# EAGLE design 8x8_ctrl (EAGLE 5.11)
RIPPLE: 500 mA
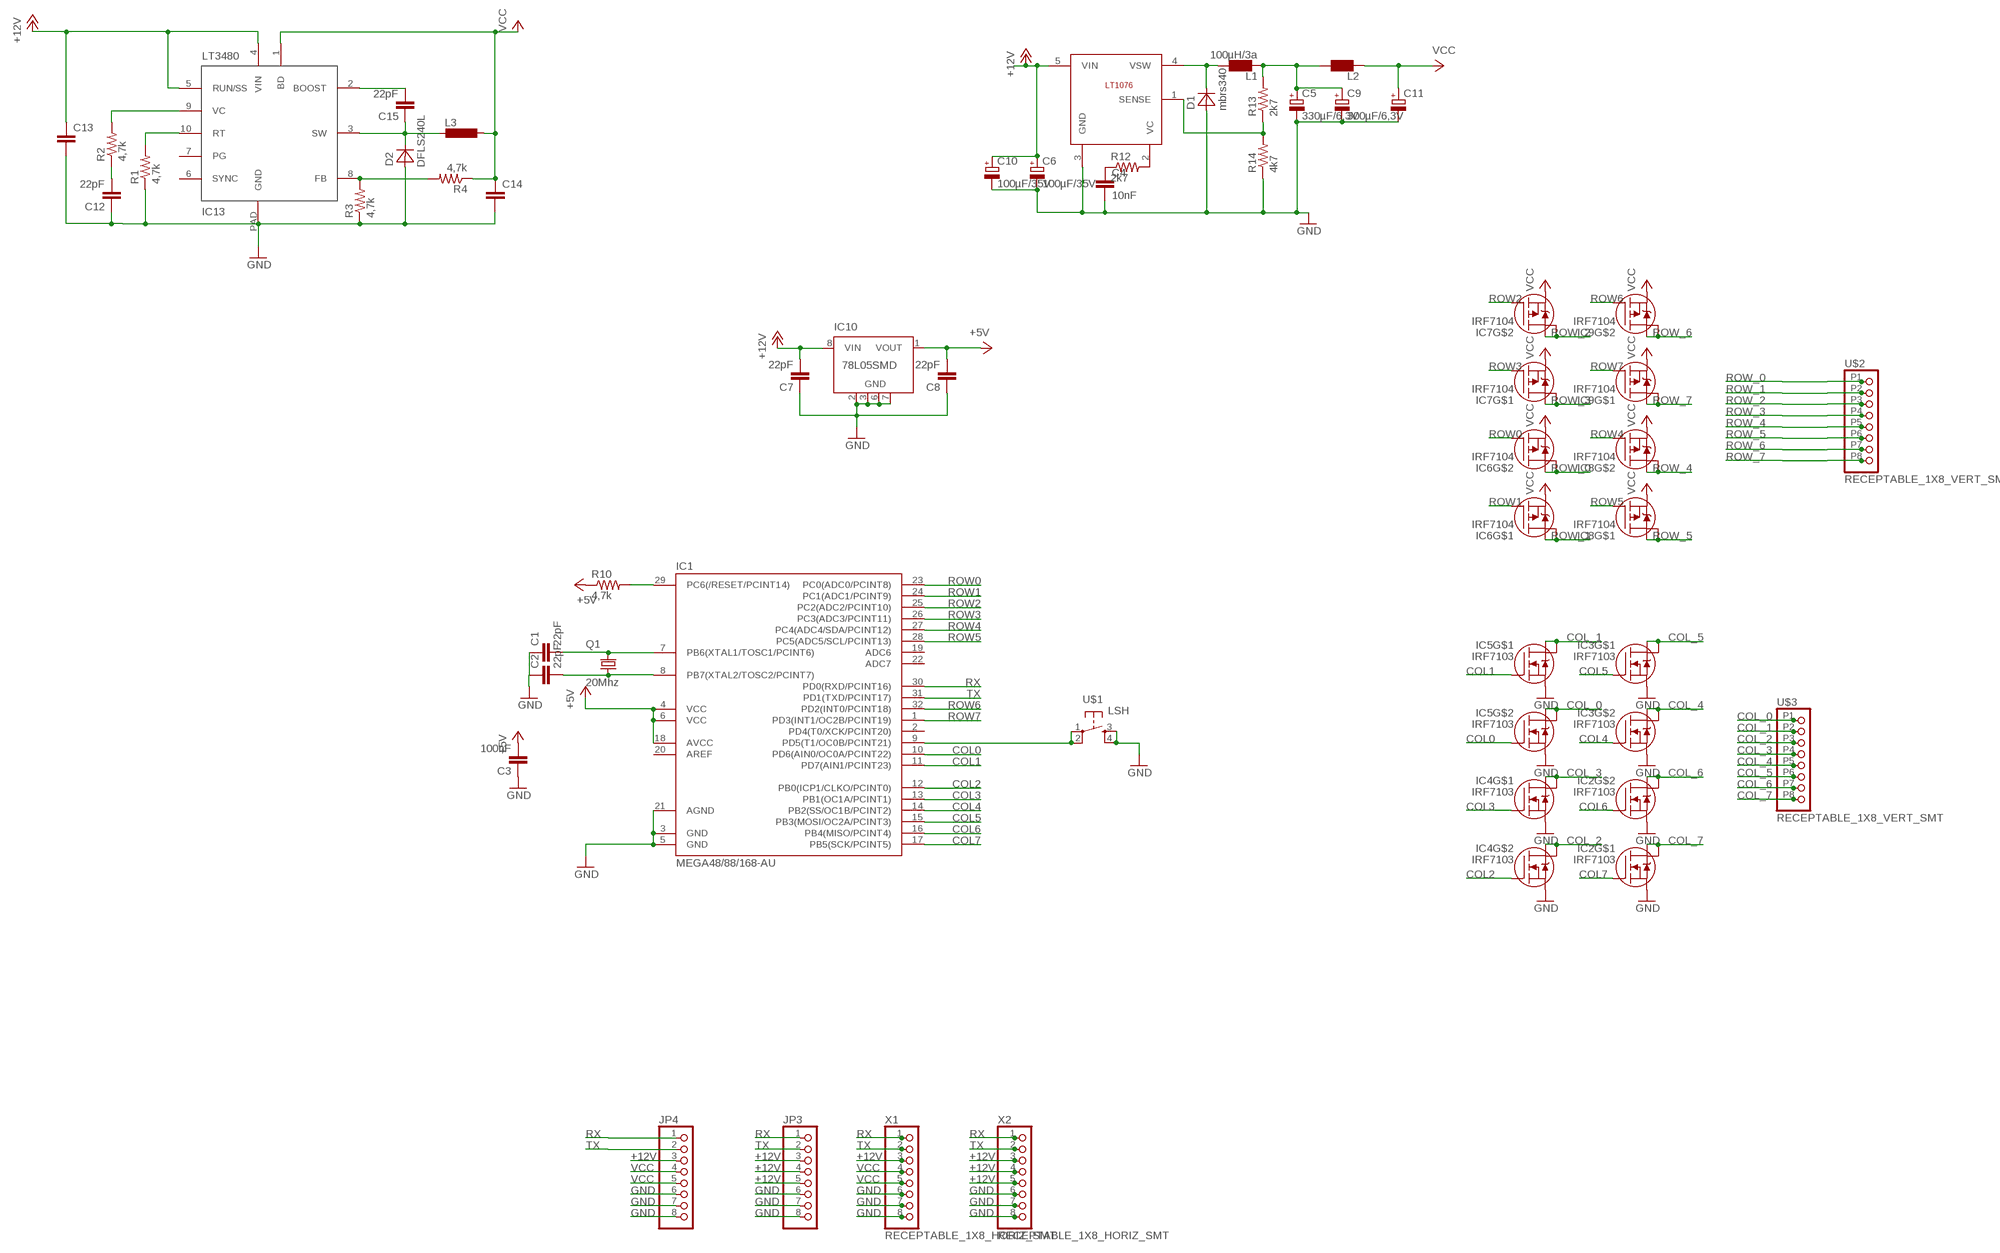
[diagram p0: schematic, sheet 1]

## Parts
C1  22pF  CAP0805  [0805]
C2  22pF  CAP0805  [0805]
C3  100nF  CAP0805  [0805]
C4  10nF  CAP0805  [0805]
C5  330µF/6,3V  CPOL-EUD  [PANASONIC_D]
C6  100µF/35V  CPOL-EUD  [PANASONIC_D]
C7  22pF  CAP0805  [0805]
C8  22pF  CAP0805  [0805]
C9  300µF/6,3V  CPOL-EUD  [PANASONIC_D]
C10  100µF/35V  CPOL-EUD  [PANASONIC_D]
C11  CPOL-EUSMCD  [SMC_D]
C12  22pF  CAP0805  [0805]
C13  CAP1210  [1210]
C14  CAP1210  [1210]
C15  22pF  CAP0805  [0805]
D1  mbrs340  MBRS340  [DO214AB]
D2  DFLS240L  [POWERDI_123]
IC1  MEGA48/88/168-AU  [TQFP32-08]
IC2  IRF7103  [SO8-2]
IC3  IRF7103  [SO8-2]
IC4  IRF7103  [SO8-2]
IC5  IRF7103  [SO8-2]
IC6  IRF7104  [SO8-2]
IC7  IRF7104  [SO8-2]
IC8  IRF7104  [SO8-2]
IC9  IRF7104  [SO8-2]
IC10  78L05SMD  [SO08]
IC12  LT1076  [Q5-DD]
IC13  LT3480  [MSOP10-PAD]
JP3  PINHD-1X08_2.54-SMD-90°  [1X08SMD/90]
JP4  PINHD-1X08_2.54-SMD-90°  [1X08SMD/90]
L1  100µH/3a  L-PISR  [PISR]
L2  L-PISG  [PISG]
L3  DO3316P  [DO3316P]
Q1  20Mhz  X22-OSCILLATOR  [X22]
R1  4,7k  RESISTOR  [0805]
R2  4,7k  RESISTOR  [0805]
R3  4,7k  RESISTOR  [0805]
R4  4,7k  RESISTOR  [0805]
R10  4,7k  RESISTOR  [0805]
R12  2k7  RESISTOR  [0805]
R13  2k7  RESISTOR  [0805]
R14  4k7  RESISTOR  [0805]
U$1  LSH  [LSH]
U$2  RECEPTABLE_1X8_VERT_SMT  [RECEPTABLE_1X8_VERT_SMT]
U$3  RECEPTABLE_1X8_VERT_SMT  [RECEPTABLE_1X8_VERT_SMT]
X1  RECEPTABLE_1X8_HORIZ_SMT  [RECEPTABLE_1X8_HORIZ_SMT]
X2  RECEPTABLE_1X8_HORIZ_SMT  [RECEPTABLE_1X8_HORIZ_SMT]

## Nets
+5V: C3.2 C8.2 IC1.4(VCC) IC1.6(VCC) IC1.18(AVCC) IC10.1(VOUT) R10.1
+12V: C6.+ C7.2 C10.+ C13.1 IC10.8(VIN) IC12.5(VIN) IC13.4(VIN) IC13.5(RUN/SS) JP3.3 JP3.4 JP3.5 JP4.3 X1.3 X1.11 X2.3 X2.4 X2.5 X2.11 X2.12 X2.13
COL0: IC1.10(PD6(AIN0/OC0A/PCINT22)) IC5.4(G)
COL1: IC1.11(PD7(AIN1/PCINT23)) IC5.2(G)
COL2: IC1.12(PB0(ICP1/CLKO/PCINT0)) IC4.4(G)
COL3: IC1.13(PB1(OC1A/PCINT1)) IC4.2(G)
COL4: IC1.14(PB2(SS/OC1B/PCINT2)) IC3.4(G)
COL5: IC1.15(PB3(MOSI/OC2A/PCINT3)) IC3.2(G)
COL6: IC1.16(PB4(MISO/PCINT4)) IC2.4(G)
COL7: IC1.17(PB5(SCK/PCINT5)) IC2.2(G)
COL_0: IC5.5(D) IC5.6(D) U$3.P1
COL_1: IC5.7(D) IC5.8(D) U$3.P2
COL_2: IC4.5(D) IC4.6(D) U$3.P3
COL_3: IC4.7(D) IC4.8(D) U$3.P4
COL_4: IC3.5(D) IC3.6(D) U$3.P5
COL_5: IC3.7(D) IC3.8(D) U$3.P6
COL_6: IC2.5(D) IC2.6(D) U$3.P7
COL_7: IC2.7(D) IC2.8(D) U$3.P8
GND: C1.1 C2.1 C3.1 C4.2 C5.- C6.- C7.1 C8.1 C9.- C10.- C11.- C12.1 C13.2 C14.2 D1.A D2.A IC1.3(GND) IC1.5(GND) IC1.21(AGND) IC2.1(S) IC2.3(S) IC3.1(S) IC3.3(S) IC4.1(S) IC4.3(S) IC5.1(S) IC5.3(S) IC10.2(GND) IC10.3(GND) IC10.6(GND) IC10.7(GND) IC12.3(GND) IC13.PAD(GND) JP3.6 JP3.7 JP3.8 JP4.6 JP4.7 JP4.8 R1.1 R3.1 R14.1 U$1.3 U$1.4 X1.6 X1.7 X1.8 X1.14 X1.15 X1.16 X2.6 X2.7 X2.8 X2.14 X2.15 X2.16
N$1: C2.2 IC1.8(PB7(XTAL2/TOSC2/PCINT7)) Q1.1
N$2: C5.+ C9.+ L1.P$2 L2.P$1 R13.2
N$3: C1.2 IC1.7(PB6(XTAL1/TOSC1/PCINT6)) Q1.3
N$4: IC1.29(PC6(/RESET/PCINT14)) R10.2
N$5: IC12.1(SENSE) R13.1 R14.2
N$6: IC13.10(RT) R1.2
N$7: IC1.9(PD5(T1/OC0B/PCINT21)) U$1.1 U$1.2
N$8: C15.1 D2.K(C) IC13.3(SW) L3.1
N$9: C12.2 R2.1
N$10: IC13.9(VC) R2.2
N$12: IC13.8(FB) R3.2 R4.2
N$15: C15.2 IC13.2(BOOST)
N$17: C4.1 R12.1
N$18: IC12.2(VC) R12.2
N$19: D1.K(C) IC12.4(VSW) L1.P$1
ROW0: IC1.23(PC0(ADC0/PCINT8)) IC6.4(G)
ROW1: IC1.24(PC1(ADC1/PCINT9)) IC6.2(G)
ROW2: IC1.25(PC2(ADC2/PCINT10)) IC7.4(G)
ROW3: IC1.26(PC3(ADC3/PCINT11)) IC7.2(G)
ROW4: IC1.27(PC4(ADC4/SDA/PCINT12)) IC8.4(G)
ROW5: IC1.28(PC5(ADC5/SCL/PCINT13)) IC8.2(G)
ROW6: IC1.32(PD2(INT0/PCINT18)) IC9.4(G)
ROW7: IC1.1(PD3(INT1/OC2B/PCINT19)) IC9.2(G)
ROW_0: IC6.5(D) IC6.6(D) U$2.P1
ROW_1: IC6.7(D) IC6.8(D) U$2.P2
ROW_2: IC7.5(D) IC7.6(D) U$2.P3
ROW_3: IC7.7(D) IC7.8(D) U$2.P4
ROW_4: IC8.5(D) IC8.6(D) U$2.P5
ROW_5: IC8.7(D) IC8.8(D) U$2.P6
ROW_6: IC9.5(D) IC9.6(D) U$2.P7
ROW_7: IC9.7(D) IC9.8(D) U$2.P8
RX: IC1.30(PD0(RXD/PCINT16)) JP3.1 JP4.1 X1.1 X1.9 X2.1 X2.9
TX: IC1.31(PD1(TXD/PCINT17)) JP3.2 JP4.2 X1.2 X1.10 X2.2 X2.10
VCC: C11.+ C14.1 IC6.1(S) IC6.3(S) IC7.1(S) IC7.3(S) IC8.1(S) IC8.3(S) IC9.1(S) IC9.3(S) IC13.1(BD) JP4.4 JP4.5 L2.P$2 L3.2 R4.1 X1.4 X1.5 X1.12 X1.13
Unconnected: IC1.2(PD4(T0/XCK/PCINT20)) IC1.19(ADC6) IC1.20(AREF) IC1.22(ADC7) IC10.4(NC) IC10.5(NC) IC13.6(SYNC) IC13.7(PG)

## Library data of the parts
C1-C4 C7 C8 C12-C15 = SparkFun:CAP: Capacitor Standard 0603 ceramic capacitor, and 0.1" leaded capacitor.
C5 C6 C9-C11 = rcl:CPOL-EU: POLARIZED CAPACITOR, European symbol
D1 = seb:MBRS340
D2 = seb:DFLS240L
IC1 = avr-4:MEGA48/88/168
IC2-IC5 = irf-2:IRF7103: HEXFET® Power MOSFET Adavanced Process Technology Ultra Low On-Resistance Dual N-Channel MOSFET Surface Mount Available in Tape & Reel Dynamic dv/dt Rating Fast Switching Please connect both Drain-Pins of each FET for thermal Reasons! (Pin 5 with Pin 6, 7 with 8)
IC6-IC9 = irf-2:IRF7104: HEXFET® Power MOSFET Adavanced Process Technology Ultra Low On-Resistance Dual P-Channel MOSFET Surface Mount Available in Tape & Reel Dynamic dv/dt Rating Fast Switching Please connect both Drain-Pins of each FET for thermal Reasons! (Pin 5 with Pin 6, 7 with 8)
IC10 = linear:78L*SMD: Positive VOLTAGE REGULATOR
IC12 = seb:LT1076
IC13 = seb:LT3480
JP3 JP4 = pinhead-2:PINHD-1X08: PIN HEADER
L1 = seb:L-PISR
L2 = seb:L-PISG
L3 = inductor-coilcraft:DO3316P: COILCRAFT; OC_FARNELL: unknown; OC_NEWARK: unknown
Q1 = seb:X22-OSCILLATOR
R1-R4 R10 R12-R14 = SparkFun:RESISTOR: Resistor Basic schematic elements and footprints for 0603, 1206, and PTH 1/10th watt (small) resistors.
U$1 = switch-tact:LSH
U$2 U$3 = seb:RECEPTABLE_1X8_VERT_SMT
X1 X2 = seb:RECEPTABLE_1X8_HORIZ_SMT

## Board
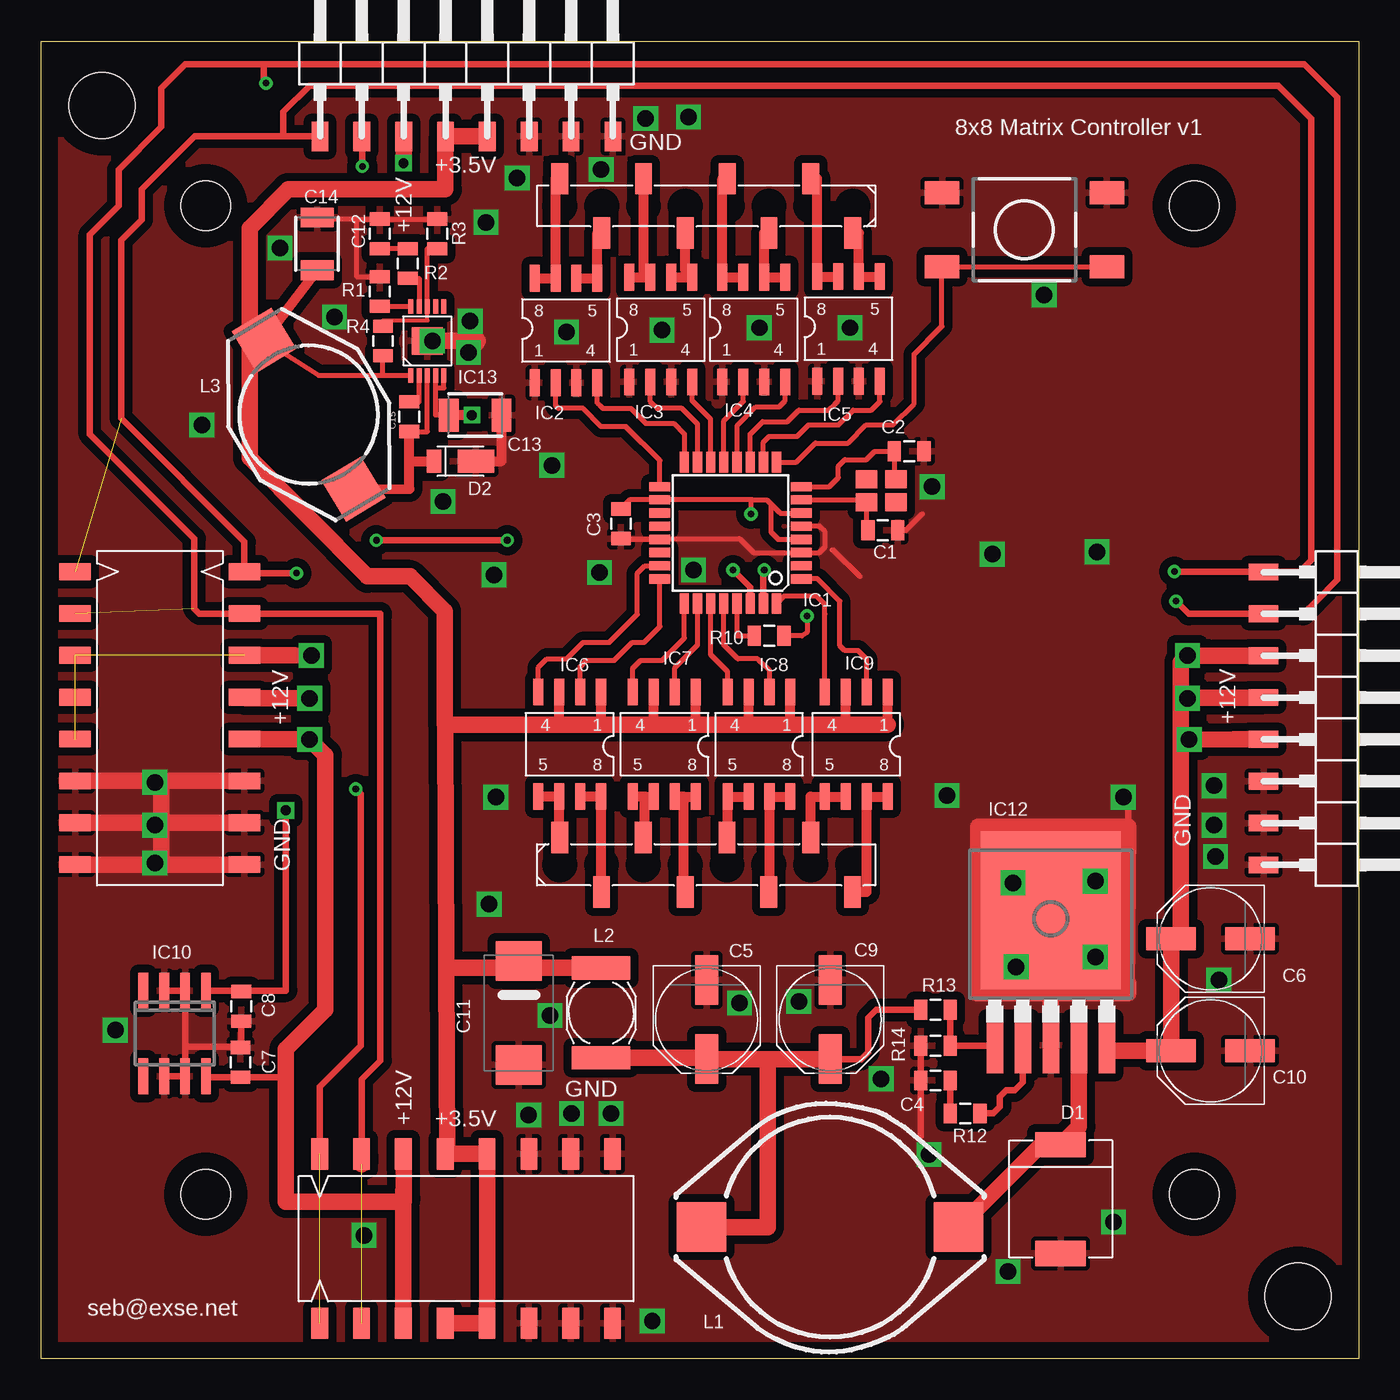
[diagram p1: board, top side]
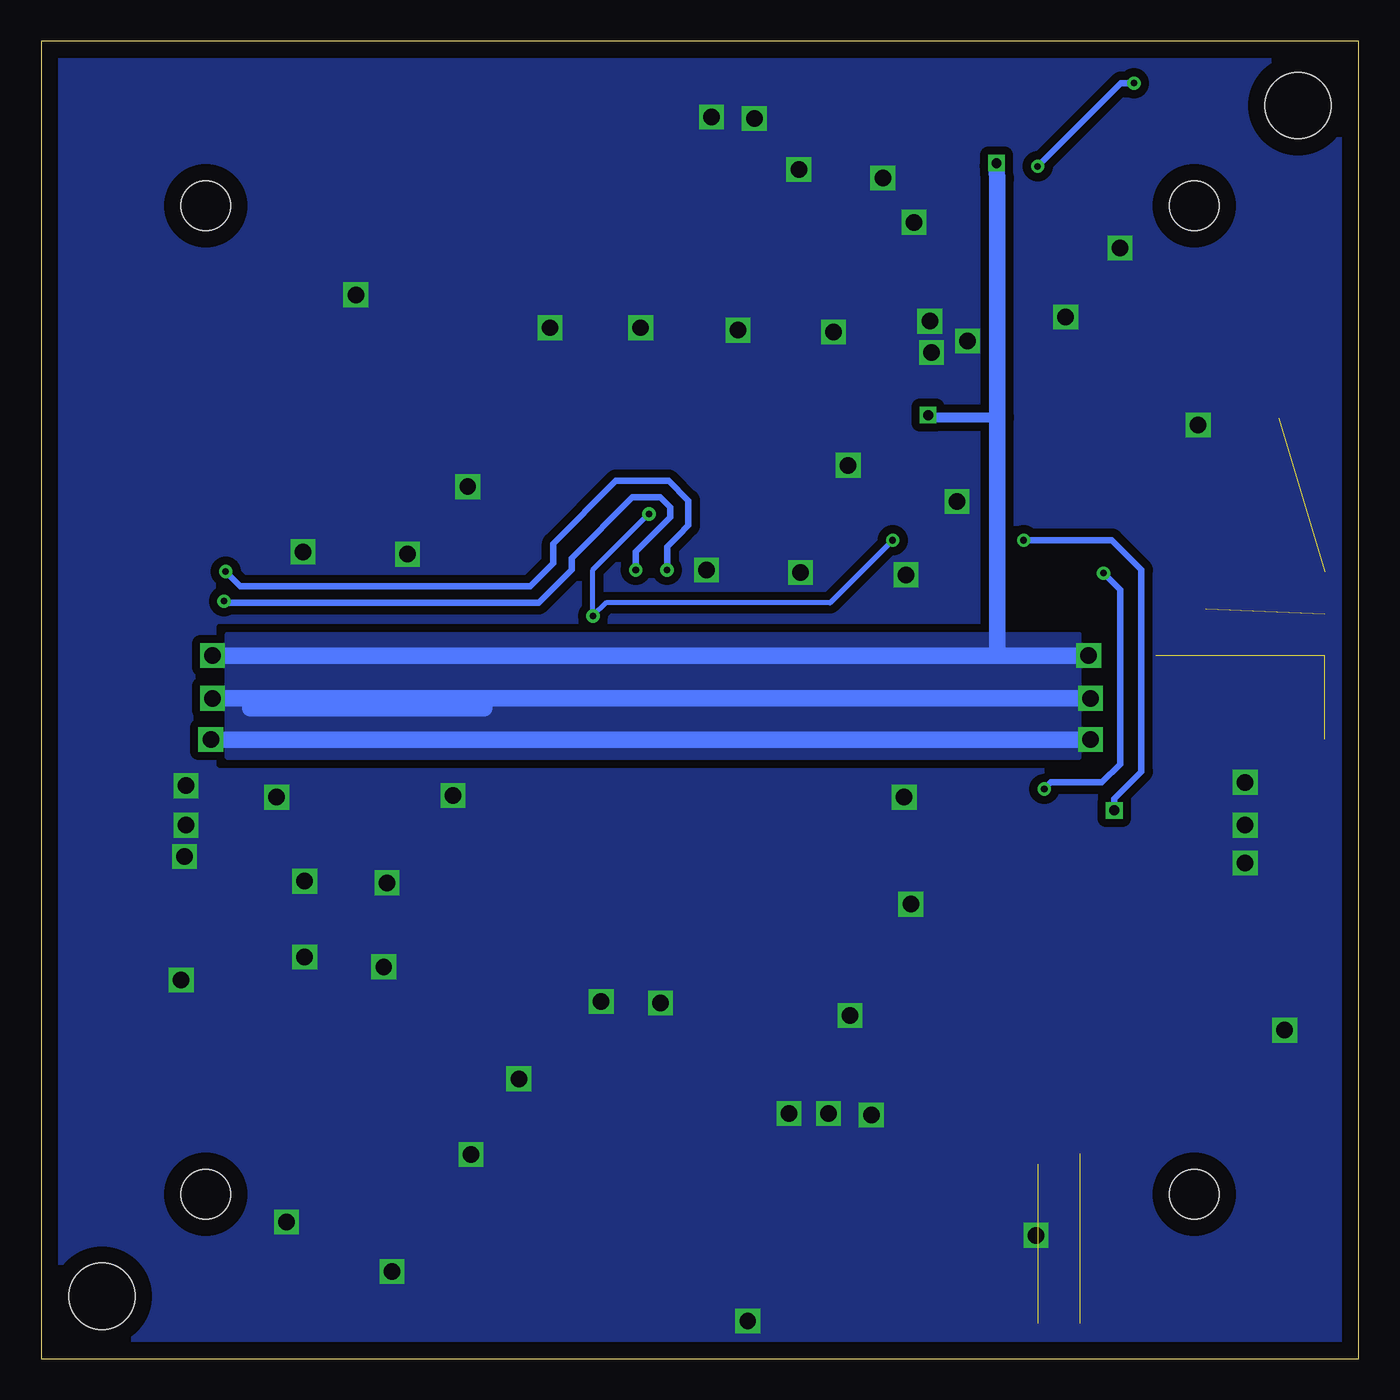
[diagram p2: board, bottom side, seen from below]

Size 80 x 80 mm. Coordinates in mm from the lower left corner, seen from the top.
Outline: 80,0 0,0 0,80 80,80 80,0
Copper layers (1*16): Top 0.035mm / dielectric 1.5mm / Bottom 0.035mm
Design rules "default *": minimum track width 10mil, minimum drill 24mil, track to track 8mil, track to pad 8mil, pad to pad 8mil, via to via 8mil, smd to smd 8mil, copper to edge 40mil, drill to drill 8mil, minimum pad ring 10mil, minimum via ring 8mil, stop-mask expansion 4mil, vias tented up to drill 40mil, thermal gap 10mil
Holes 3 mm at 70,70 10,70 10,10 70,10
Holes 4 mm at 3.7,76.1 76.3,3.8

### Footprints (pad centres in the part's own frame; a part is rotated, then mirrored left to right if it is on the bottom)
0805 = smd 0.8 x 1.2: 1 -0.9,0; 2 0.9,0
PANASONIC_D = smd 3 x 1.4: + 2.4,0; - -2.4,0
SMC_D = smd 2.4 x 2.8: + -3.15,0; - 3.15,0
1210 = smd 1.2 x 2: 1 -1.6,0; 2 1.6,0
DO214AB = smd 1.52 x 3.07: A 3.305,0; K -3.305,0
POWERDI_123 = smd 2.2 x 1.4: A -0.95,0 | smd 0.9 x 1.4: K 1.6,0
TQFP32-08 = smd 1.27 x 0.559: 1 -4.293,2.8; 2 -4.293,2; 3 -4.293,1.2; 4 -4.293,0.4; 5 -4.293,-0.4; 6 -4.293,-1.2; 7 -4.293,-2; 8 -4.293,-2.8; 17 4.293,-2.8; 18 4.293,-2; 19 4.293,-1.2; 20 4.293,-0.4; 21 4.293,0.4; 22 4.293,1.2; 23 4.293,2; 24 4.293,2.8 | smd 0.559 x 1.27: 9 -2.8,-4.293; 10 -2,-4.293; 11 -1.2,-4.293; 12 -0.4,-4.293; 13 0.4,-4.293; 14 1.2,-4.293; 15 2,-4.293; 16 2.8,-4.293; 25 2.8,4.293; 26 2,4.293; 27 1.2,4.293; 28 0.4,4.293; 29 -0.4,4.293; 30 -1.2,4.293; 31 -2,4.293; 32 -2.8,4.293
SO8-2 = smd 0.61 x 1.626: 1 -2.54,-2.54; 2 -1.27,-2.54; 3 0,-2.54; 4 1.27,-2.54; 5 1.27,3.81; 6 0,3.81; 7 -1.27,3.81; 8 -2.54,3.81
SO08 = smd 0.6 x 2.2: 1 -1.905,-2.6; 2 -0.635,-2.6; 3 0.635,-2.6; 4 1.905,-2.6; 5 1.905,2.6; 6 0.635,2.6; 7 -0.635,2.6; 8 -1.905,2.6
Q5-DD = smd 1 x 3.4: 1 -3.4,-7.875; 2 -1.7,-7.875; 3 0,-7.875; 4 1.7,-7.875; 5 3.4,-7.875 | smd 8.5 x 9.6: 6 0,0.325
MSOP10-PAD = smd 0.305 x 0.889: 1 -1,-2.095; 2 -0.5,-2.095; 3 0,-2.095; 4 0.5,-2.095; 5 1,-2.095; 6 1,2.095; 7 0.5,2.095; 8 0,2.095; 9 -0.5,2.095; 10 -1,2.095 | smd 1.88 x 1.68: PAD 0,0
1X08SMD/90 = smd 1.016 x 1.778: 1 -1.27,-5.08; 2 1.27,-5.08; 3 3.81,-5.08; 4 6.35,-5.08; 5 8.89,-5.08; 6 11.43,-5.08; 7 13.97,-5.08; 8 16.51,-5.08
PISR = smd 3 x 3: P$1 -7.8,0; P$2 7.8,0
PISG = smd 1.4 x 3.56: P$1 -2.73,0; P$2 2.73,0
DO3316P = smd 2.92 x 2.79: 1 -5.28,0; 2 5.28,0
X22 = smd 1.3 x 1.1: 1 0.9,0.7; 2 -0.9,0.7; 3 -0.9,-0.7; 4 0.9,-0.7
LSH = smd 2.1 x 1.4: 1 -5.005,2.24; 2 5.015,2.24; 3 -5.005,-2.24; 4 5.005,-2.24
RECEPTABLE_1X8_VERT_SMT = smd 1.02 x 1.9: P1 -7.62,1.65; P2 -5.08,-1.65; P3 -2.54,1.65; P4 0,-1.65; P5 2.54,1.65; P6 5.08,-1.65; P7 7.62,1.65; P8 10.16,-1.65
RECEPTABLE_1X8_HORIZ_SMT = smd 1.016 x 1.905: 1 -8.89,-5.144; 2 -6.35,-5.144; 3 -3.81,-5.144; 4 -1.27,-5.144; 5 1.27,-5.144; 6 3.81,-5.144; 7 6.35,-5.144; 8 8.89,-5.144; 9 -8.89,5.144; 10 -6.35,5.144; 11 -3.81,5.144; 12 -1.27,5.144; 13 1.27,5.144; 14 3.81,5.144; 15 6.35,5.144; 16 8.89,5.144

### Placement (x,y rotation side)
C1  51.1,50.3 180 top
C2  52.7,55.1 180 top
C3  35.2,50.7 90 top
C4  54.3,16.9 180 top
C5  40.4,20.6 270 top
C6  71,25.5 180 top
C7  12.1,18 270 top
C8  12.15,21.4 90 top
C9  47.9,20.6 270 top
C10  71,18.7 180 top
C11  29,21 270 top
C12  20.55,68.3 270 top
C13  26.35,57.3 0 top
C14  16.75,67.7 90 top
C15  22.35,57.2 90 top
D1  61.9,9.7 270 top
D2  25.45,54.5 180 top
IC1  41.85,50.15 180 top
IC2  32.5,61.8 0 top
IC3  38.25,61.85 0 top
IC4  43.9,61.85 0 top
IC5  49.65,61.9 0 top
IC6  31.45,37.95 180 top
IC7  37.2,37.95 180 top
IC8  42.95,37.95 180 top
IC9  48.85,37.95 180 top
IC10  8.1,19.75 180 top
IC12  61.3,26.9 0 top
IC13  23.45,61.8 0 top
JP3  79.3,46.5 270 top
JP4  18.2,79.3 0 top
L1  47.9,8 180 top
L2  34,21 90 top
L3  16.25,57.32 121 top
Q1  51,52.7 0 top
R1  20.55,64.8 270 top
R2  22.25,66.5 270 top
R3  24.05,68.3 270 top
R4  20.75,61.8 90 top
R10  44.2,43.9 180 top
R12  56.1,14.9 0 top
R13  54.3,21.2 180 top
R14  54.3,19 0 top
U$1  59.7,68.55 180 top
U$2  39.1,30 0 top
U$3  41.65,70 180 top
X1  25.8,7.3 0 top
X2  7.2,38.9 270 top

### Tracks (layer width: path | path; a pad name or v marks a point on that pad's centre or on a via)
+5V  (via drill 0.4, 0.6)
  Top 0.305: C3.2 35.75,52.15 IC1.18 43.2,52.15 | 43.2,52.15 44.05,52.15 44.1,52.1 | 44.1,52.1 44.8,51.4 44.85,51.35 IC1.6 | IC1.4 44.75,49.75 44.3,50.2 44.3,51.9 44.1,52.1 | R10.1 46.2,43.9 46.5,44.1 v46.5,45.1 | v43.1,51.3 43.1,52.05 43.2,52.15
  Top 0.406: 12.15,22.35 C8.2 | IC10.1 12.15,22.35 | 12.15,22.35 14.85,22.35 v14.85,33.3 | v20.35,49.7 v28.3,49.7
  Bottom 0.305: v43.1,51.3 46.5,47.9 v46.5,45.1 45.7,45.9 32.1,45.9 v28.3,49.7
  Bottom 0.406: v14.85,33.3 14.85,34 13.2,35.65 13.2,47.9 15,49.7 v20.35,49.7
+12V  (via drill 0.6, 1)  (3 unrouted)
  Top 0.305: 23.95,57.3 23.95,58.95 | 23.95,58.95 IC13.4 | 23.95,57.3 C13.1 23.95,57.3 | IC13.5 24.45,58.95 23.95,58.95
  Top 0.406: IC10.8 10.01,17.1 C7.2 14.85,17.1 14.85,16.3
  Top 0.61: v26.15,57.3 C13.1
  Top 1.016: X2.11 15.41,42.71 v16.4,42.7 | JP3.3 70.81,42.69 v69.6,42.7 69.2,42.3 69.2,35.6 69.2,33.8 69.2,27.6 69.2,25.5 C6.+ C10.+ 64.7,18.7 IC12.5 | X2.12 12.41,40.1 v16.3,40.1 | v69.6,40.1 69.65,40.15 JP3.4 | 14.75,37.63 X2.13 | 14.75,37.63 15.57,37.63 v16.3,37.6 17.25,36.65 17.25,21.2 14.85,18.8 14.85,16.3 14.85,9.55 22.01,9.55 | v69.7,37.6 72.41,37.61 JP3.5 | X1.11 22.01,12.34 22.01,9.55 | 14.75,37.63 14.85,37.63 | X1.3 21.99,10.23 22.01,9.55 | JP4.3 v22,72.6
  Bottom 0.61: v26.15,57.3 25.9,57.15 21.95,57.15
  Bottom 1.016: v16.4,42.7 22.3,42.7 | 22.3,42.7 v69.6,42.7 | v16.3,40.1 53.1,40.1 | 53.1,40.1 v69.6,40.1 | v16.3,37.6 v69.7,37.6 | 67.3,39.5 53.1,39.5 53.1,40.1 | v22,72.6 21.95,71.65 21.95,57.15 21.95,48.2 21.95,42.7 22.3,42.7
  pour Bottom: 17,36.5 68.7,36.5 68.7,44 17,44
COL0
  Top 0.305: IC1.10 43.85,55.65 44.2,56 45.9,56 46.6,56.7 48.4,56.7 49.3,57.6 50.4,57.6 50.8,58 50.92,58.12 IC5.4
COL1
  Top 0.305: IC1.11 43.05,56.15 43.8,56.9 45.3,56.9 46,57.6 47.8,57.6 48.2,58 48.38,58.18 IC5.2
COL2
  Top 0.305: IC1.12 42.25,56.65 43.4,57.8 44.8,57.8 45.1,58.1 45.17,58.17 IC4.4
COL3
  Top 0.305: IC1.13 41.45,56.95 42.63,58.13 IC4.2
COL4
  Top 0.305: IC1.14 40.65,57.05 40.2,57.5 39.52,58.18 IC3.4
COL5
  Top 0.305: IC1.15 39.85,56.75 38.9,57.7 37.4,57.7 37.1,58 36.98,58.12 IC3.2
COL6
  Top 0.305: IC1.16 39.05,56.15 38.4,56.8 36.7,56.8 35.8,57.7 34.1,57.7 33.9,57.9 33.77,58.03 IC2.4
COL7
  Top 0.305: IC1.17 37.56,54.54 35.5,56.6 34,56.6 32.9,57.7 31.4,57.7 31.3,57.8 31.23,57.87 IC2.2
COL_0
  Top 0.61: IC5.5 IC5.6 49.65,68.35 U$3.P1
COL_1
  Top 0.61: IC5.7 IC5.8 47.11,71.65 U$3.P2
COL_2
  Top 0.61: IC4.5 IC4.6 43.9,68.35 U$3.P3
COL_3
  Top 0.61: IC4.7 IC4.8 41.36,71.65 U$3.P4
COL_4
  Top 0.61: IC3.6 IC3.5 39.11,66.07 U$3.P5
COL_5
  Top 0.61: IC3.8 IC3.7 36.57,66.07 U$3.P6
COL_6
  Top 0.61: IC2.6 IC2.5 33.77,68.35 U$3.P7
COL_7
  Top 0.61: IC2.8 IC2.7 31.23,71.65 U$3.P8
GND  (via drill 1)
  Top 0.305: IC1.21 35.2,49.75 C3.1 42.4,49.8 43.1,49.1 43.25,48.95 IC1.3 47.25,48.95 47.4,49.1 47.6,49.3 47.6,50.2 47.25,50.55 IC1.5 | C1.1 52.5,50.3 53.5,51.3 | 48,49.1 48.1,49.1 49.7,47.5 | R1.1 19.15,65.7 19.15,68.5 19.15,69.2 | 19.15,69.2 C12.1 R3.1 | C14.2 16.75,69.2 19.15,69.2
  Top 0.406: C4.2 R14.1 53.4,13.5 | IC10.6 IC10.7 8.73,18.95 | IC10.3 IC10.2 8.73,18.95 | 9.1,30.01 10.79,30.01 | 8.73,18.95 12.1,18.95 C7.1 12.15,18.9 C8.1 | v65.7,34.1 66,33.8 66,32.3
  Top 0.61: D2.A 27.95,54.5 C13.2
  Top 1.016: X2.6 X2.14 7.3,35.09 7.3,32.9 | 7.3,32.55 X2.7 | 7.3,32.55 X2.15 | X2.8 9.1,30.01 | 9.1,30.01 X2.16 9.1,30.01 | 7.3,32.9 7.3,32.55 | 9.1,30.01 7.3,30.01 7.3,32.9 | IC12.3 61.3,24.85 61.3,26.55 | 65.9,22.3 66,32.3 56.9,32.3 56.8,22.3 56.8,22.2 56.9,22.2 66,22.2 66,22.8 | IC13.PAD 26.5,61.8 v25.95,61.1
  other vias: 53.9,12.4 64,29 51,17 71.5,23 59,28.9 64,24.4 4.5,19.95 54.1,52.95 60.9,64.6 28.9,71.7 27,69 57.75,48.85 43.6,62.6 55,34.2 27.5,47.6 33.9,47.75 31.9,62.35 42.4,21.6 19.6,7.5 46,21.7 49.1,62.6 34,72.2 39.3,75.4 59.2,23.8 39.6,47.9 37.1,2.3 9.75,56.7 71.3,30.5 71.2,32.4 71.2,34.8 6.9,30.1 6.9,32.4 6.9,35 29.6,14.8 27.2,27.6 30.89,20.85 27.6,34.1 37.7,62.45 36.7,75.3 31,54.25 64.1,49 65.1,8.3 58.7,5.3 32.2,14.9 34.6,14.9 17.8,63.25 24.4,52.05 14.5,67.45 23.75,61.8 26.05,63
  pour Top (isolate 0.5, rank 2): 0,80 80,80 80,0 0,0
  pour Bottom (isolate 0.5, rank 2): 0,80 80,80 80,0 0,0
N$1
  Top 0.305: Q1.1 51.8,53.5 C2.2 50.6,55.1 50.1,54.6 48.8,54.6 48.4,54.2 48.4,53.5 47.85,52.95 IC1.8
N$2
  Top 0.406: C9.+ 49.8,18.2 50.2,18.6 50.2,20.7 50.6,21.1 50.7,21.2 R13.2
  Top 1.016: L1.P$2 40.6,8 L1.P$2 | 44.1,18.2 C5.+ 40.4,18.27 L2.P$1 | 44.1,18.2 C9.+ | L1.P$2 44.1,8 44.1,18.2
N$3
  Top 0.305: C1.2 50.1,50.4 Q1.3 49.95,52.15 IC1.7
N$4
  Top 0.305: R10.2 42.25,43.9 IC1.29
N$5
  Top 0.406: IC12.1 57.9,19 R14.2 R13.1
N$6
  Top 0.305: IC13.10 20.75,63.9 R1.2
N$7
  Top 0.305: IC1.9 45.84,54.44 47,55.6 49,55.6 50.1,56.7 51.1,56.7 51.7,56.7 53,58 53,61 54.6,62.6 54.69,62.69 U$1.2 U$1.1
N$8
  Top 0.305: IC13.3 23.45,56.3 C15.1
  Top 0.61: L3.1 22.35,52.82 22.35,54.6 | 22.35,54.6 C15.1 | D2.K 22.55,54.5 22.35,54.6
N$9
  Top 0.305: R2.1 C12.2
N$10
  Top 0.305: IC13.9 22.95,65.6 R2.2
N$12
  Top 0.254: IC13.8 23.45,63.05 21.4,63.05 20.75,63.05 R4.2
  Top 0.305: IC13.8 23.45,67.4 R3.2
N$15
  Top 0.305: IC13.2 22.95,58.1 C15.2
N$17
  Top 0.406: R12.1 55.2,15 C4.1
N$18
  Top 0.406: R12.2 57.8,14.9 58.2,15.3 58.2,15.9 58.6,16.3 59.1,16.3 59.3,16.5 59.6,16.8 IC12.2
N$19
  Top 1.016: L1.P$1 60.7,13.01 D1.K 63,14.11 IC12.4
ROW0
  Top 0.305: IC1.23 36.65,48.15 36.2,47.7 36.2,45.2 34.5,43.5 32.9,43.5 31.9,42.5 30.7,42.5 30.4,42.2 30.18,41.98 IC6.4
ROW1
  Top 0.305: IC1.24 37.56,44.46 36.6,43.5 35.9,43.5 34.8,42.4 33.1,42.4 32.9,42.2 32.72,42.02 IC6.2
ROW2
  Top 0.305: IC1.25 39.05,43.75 37.7,42.4 36.4,42.4 36.2,42.2 35.93,41.93 IC7.4
ROW3
  Top 0.305: IC1.26 39.85,43.35 39.1,42.6 38.47,41.97 IC7.2
ROW4
  Top 0.305: IC1.27 40.65,42.75 41.3,42.1 41.68,41.72 IC8.4
ROW5
  Top 0.305: IC1.28 41.45,43.35 42.3,42.5 43.5,42.5 43.7,42.3 44.22,41.78 IC8.2
ROW6
  Top 0.305: IC9.4 47.58,45.22 47.58,45.82 47.1,46.3 45.09,46.3 IC1.32
ROW7
  Top 0.305: IC1.1 47.15,47.35 48.5,46 48.5,43.3 48.8,43 49.6,43 49.9,42.7 50.12,42.48 IC9.2
ROW_0
  Top 0.61: IC6.5 IC6.6 31.45,31.65 U$2.P1
ROW_1
  Top 0.61: IC6.7 IC6.8 33.99,28.35 U$2.P2
ROW_2
  Top 0.61: 36.65,34.14 IC7.5 | 36.65,34.14 IC7.6 | U$2.P3 36.65,31.65 36.65,34.14
ROW_3
  Top 0.61: 39,34.14 IC7.7 | 39,34.14 IC7.8 | U$2.P4 39,28.35 39,34.14
ROW_4
  Top 0.61: IC8.6 IC8.5 41.68,31.65 U$2.P5
ROW_5
  Top 0.61: IC8.8 IC8.7 44.22,28.35 U$2.P6
ROW_6
  Top 0.61: IC9.6 IC9.5 46.72,34.14 U$2.P7
ROW_7
  Top 0.61: U$2.P8 50.12,28.35 IC9.7 IC9.8
RX  (via drill 0.4)  (2 unrouted)
  Top 0.406: X2.1 | X1.9 16.91,16.51 19.4,19 19.4,34.3 v19.1,34.6 | v15.5,47.7 12.43,47.7 X2.9 12.34,49.61 4.85,57.1 4.85,67.9 6.1,69.15 6.1,71 8.5,73.4 9.32,74.22 14.7,74.22 | IC1.30 43.05,46.85 v42,47.9 | v68.8,47.8 74.19,47.8 JP3.1 74.25,47.8 76.4,47.8 77.1,48.5 77.1,75.3 75.1,77.3 16.3,77.3 14.7,75.7 14.7,74.22 | 14.7,74.22 JP4.1
  Bottom 0.406: v19.1,34.6 18.7,35 15.6,35 14.5,36.1 14.5,40.2 14.5,46.7 v15.5,47.7 | v68.8,47.8 67.9,46.9 50.3,46.9 48.9,48.3 48.9,49.5 45.1,53.3 44.1,53.3 41.9,53.3 40.7,52.1 40.7,50.6 41.3,50 42,49.3 v42,47.9
TX  (via drill 0.4)  (2 unrouted)
  Top 0.406: 19.47,11.8 19.45,11.8 19.45,16.95 19.5,17 20.6,18.1 20.6,45.1 20.6,45.25 X2.10 9.6,45.25 9.3,45.55 9.3,49.8 2.95,56.15 2.95,68.25 4.7,70 4.7,72.2 7.3,74.8 7.3,77.15 8.75,78.6 13.5,78.6 | IC1.31 43.85,47.85 v43.9,47.9 | v68.9,46 69.67,45.23 JP3.2 76.63,45.23 77.4,46 78.7,47.3 78.7,53 78.7,76.6 76.7,78.6 74.7,78.6 15.3,78.6 13.5,78.6 | JP4.2 19.5,74.19 v19.5,72.4 | v13.65,77.45 13.5,77.6 13.5,78.6
  Top 1.016: X1.10 19.45,11.8
  Bottom 0.406: v68.9,46 68.8,45.9 49.8,45.9 47.8,47.9 47.8,48.6 44.1,52.3 42.4,52.3 41.8,51.7 41.8,51.1 42.9,50 43.9,49 v43.9,47.9 | v19.5,72.4 14.45,77.45 v13.65,77.45
VCC
  Top 0.305: 20.75,59.71 16.85,59.71 13.95,61.58 L3.2 | 20.75,59.71 IC13.1 | 20.75,59.71 R4.1
  Top 0.406: X1.12 24.57,12.3 24.64,12.3
  Top 0.61: IC9.1 51.39,38.5 51.25,38.5 | IC9.3 48.85,38.5 48.7,38.5 | IC8.1 45.49,38.5 45.4,38.5 | IC8.3 42.95,38.5 42.85,38.5 | IC7.1 39.74,38.5 39.65,38.5 | IC7.3 37.2,38.5 37.3,38.5 | IC6.1 33.99,38.5 33.95,38.5 | IC6.3 31.45,38.5 31.5,38.5 | L3.2 C14.1
  Top 1.016: JP4.4 JP4.5 JP4.4 24.54,71 15.2,71 15,71 12.65,68.65 | X1.12 X1.13 27.07,8 X1.5 X1.4 | 24.64,12.3 24.59,24 | 24.59,24 24.54,38.5 | 24.54,38.5 31.45,38.5 31.5,38.5 33.95,38.5 33.99,38.5 37.2,38.5 37.3,38.5 39.65,38.5 39.74,38.5 42.85,38.5 42.95,38.5 45.4,38.5 45.49,38.5 48.7,38.5 48.85,38.5 51.25,38.5 51.39,38.5 | 29,23.73 L2.P$2 | 29,23.73 C11.+ | 29,23.73 24.59,23.73 24.59,24 | 12.65,62.33 13.95,61.58 | 12.65,62.33 12.65,54.7 19.8,47.5 22.4,47.5 24.5,45.4 24.5,38.54 24.54,38.5 | 12.65,62.33 12.65,68.65 | 12.65,62.33 12.65,68.65

### Text on the board
tPlace: 8x8 Matrix Controller v1 | GND | +3.5V | +12V | +12V | +12V | GND | GND | GND | +12V | +3.5V | seb@exse.net